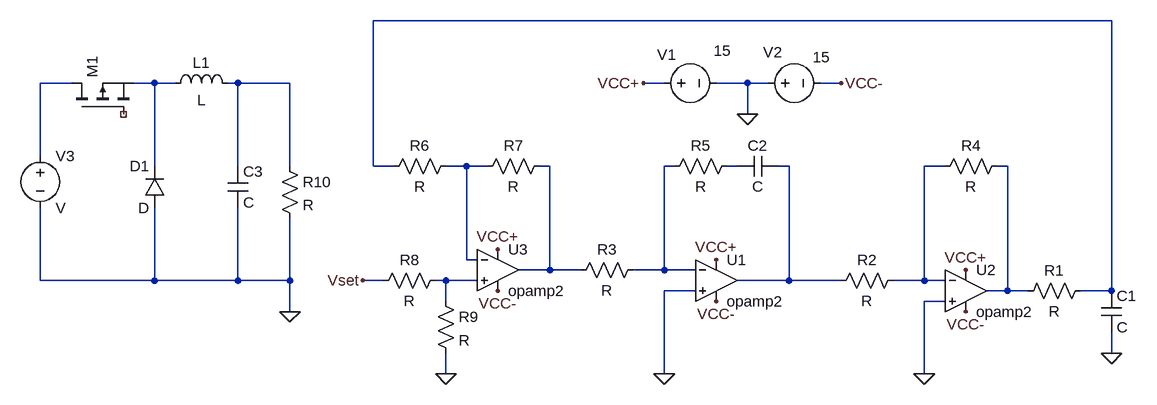
[diagram p0: schematic Pi_e_Buck_implementadando.asc]
Pi_e_Buck_implementadando.asc, the LTspice schematic file:
Version 4
SHEET 1 880 772
WIRE 768 -272 -368 -272
WIRE -832 -176 -880 -176
WIRE -704 -176 -736 -176
WIRE -672 -176 -704 -176
WIRE -576 -176 -592 -176
WIRE -496 -176 -576 -176
WIRE 80 -176 48 -176
WIRE 208 -176 160 -176
WIRE 240 -176 208 -176
WIRE 352 -176 320 -176
WIRE 208 -128 208 -176
WIRE -880 -64 -880 -176
WIRE -704 -48 -704 -176
WIRE -576 -48 -576 -176
WIRE -496 -48 -496 -176
WIRE -368 -48 -368 -272
WIRE -336 -48 -368 -48
WIRE -224 -48 -256 -48
WIRE -192 -48 -224 -48
WIRE -96 -48 -112 -48
WIRE 96 -48 80 -48
WIRE 192 -48 176 -48
WIRE 272 -48 256 -48
WIRE 512 -48 480 -48
WIRE 608 -48 592 -48
WIRE -224 96 -224 -48
WIRE -208 96 -224 96
WIRE -96 112 -96 -48
WIRE -96 112 -144 112
WIRE -48 112 -96 112
WIRE 80 112 80 -48
WIRE 80 112 32 112
WIRE 128 112 80 112
WIRE -880 128 -880 16
WIRE -704 128 -704 16
WIRE -704 128 -880 128
WIRE -576 128 -576 16
WIRE -576 128 -704 128
WIRE -496 128 -496 32
WIRE -496 128 -576 128
WIRE -352 128 -384 128
WIRE -256 128 -272 128
WIRE -208 128 -256 128
WIRE 272 128 272 -48
WIRE 272 128 192 128
WIRE 352 128 272 128
WIRE 480 128 480 -48
WIRE 480 128 432 128
WIRE 512 128 480 128
WIRE 128 144 80 144
WIRE 608 144 608 -48
WIRE 608 144 576 144
WIRE 640 144 608 144
WIRE 768 144 768 -272
WIRE 768 144 720 144
WIRE -256 160 -256 128
WIRE 512 160 480 160
WIRE -496 176 -496 128
WIRE 768 240 768 208
WIRE -256 272 -256 240
WIRE 80 272 80 144
WIRE 480 272 480 160
FLAG 768 240 0
FLAG -256 272 0
FLAG 80 272 0
FLAG 480 272 0
FLAG -384 128 Vset
FLAG -176 80 VCC+
FLAG 160 96 VCC+
FLAG 544 112 VCC+
FLAG -176 144 VCC-
FLAG 160 160 VCC-
FLAG 544 176 VCC-
FLAG 208 -128 0
FLAG 352 -176 VCC-
FLAG 48 -176 VCC+
FLAG -496 176 0
SYMBOL OpAmps\\opamp2 160 64 R0
SYMATTR InstName U1
SYMBOL OpAmps\\opamp2 544 80 R0
SYMATTR InstName U2
SYMBOL OpAmps\\opamp2 -176 48 R0
SYMATTR InstName U3
SYMBOL cap 752 144 R0
SYMATTR InstName C1
SYMBOL res 736 128 R90
WINDOW 0 0 56 VBottom 2
WINDOW 3 32 56 VTop 2
SYMATTR InstName R1
SYMBOL res 448 112 R90
WINDOW 0 0 56 VBottom 2
WINDOW 3 32 56 VTop 2
SYMATTR InstName R2
SYMBOL res 48 96 R90
WINDOW 0 0 56 VBottom 2
WINDOW 3 32 56 VTop 2
SYMATTR InstName R3
SYMBOL res 608 -64 R90
WINDOW 0 0 56 VBottom 2
WINDOW 3 32 56 VTop 2
SYMATTR InstName R4
SYMBOL res 192 -64 R90
WINDOW 0 0 56 VBottom 2
WINDOW 3 32 56 VTop 2
SYMATTR InstName R5
SYMBOL cap 256 -64 R90
WINDOW 0 0 32 VBottom 2
WINDOW 3 32 32 VTop 2
SYMATTR InstName C2
SYMBOL res -240 -64 R90
WINDOW 0 0 56 VBottom 2
WINDOW 3 32 56 VTop 2
SYMATTR InstName R6
SYMBOL res -96 -64 R90
WINDOW 0 0 56 VBottom 2
WINDOW 3 32 56 VTop 2
SYMATTR InstName R7
SYMBOL res -256 112 R90
WINDOW 0 0 56 VBottom 2
WINDOW 3 32 56 VTop 2
SYMATTR InstName R8
SYMBOL voltage 64 -176 R270
WINDOW 123 0 0 Left 0
WINDOW 39 0 0 Left 0
WINDOW 0 44 5 VRight 2
WINDOW 3 50 92 VRight 2
SYMATTR InstName V1
SYMATTR Value 15
SYMBOL voltage 224 -176 R270
WINDOW 123 0 0 Left 0
WINDOW 39 0 0 Left 0
WINDOW 0 48 8 VRight 2
WINDOW 3 40 84 VRight 2
SYMATTR InstName V2
SYMATTR Value 15
SYMBOL res -272 144 R0
SYMATTR InstName R9
SYMBOL voltage -880 -80 R0
SYMATTR InstName V3
SYMBOL ind -688 -160 R270
WINDOW 0 32 56 VTop 2
WINDOW 3 5 56 VBottom 2
SYMATTR InstName L1
SYMBOL diode -688 16 R180
WINDOW 0 24 64 Left 2
WINDOW 3 24 0 Left 2
SYMATTR InstName D1
SYMBOL res -512 -64 R0
SYMATTR InstName R10
SYMBOL cap -592 -48 R0
SYMATTR InstName C3
SYMBOL pmos -832 -128 R270
SYMATTR InstName M1
SYMATTR Value ""

The netlist it stands for:
* Pi_e_Buck_implementadando.asc
XU1 0 N007 VCC+ VCC- N009 opamp2  ; pins In+ In- V+ V- OUT
XU2 0 N010 VCC+ VCC- N011 opamp2  ; pins In+ In- V+ V- OUT
XU3 N012 N005 VCC+ VCC- N006 opamp2  ; pins In+ In- V+ V- OUT
C1 N001 0 C
R1 N001 N011 R
R2 N010 N009 R
R3 N007 N006 R
R4 N011 N010 R
R5 N008 N007 R
C2 N009 N008 C
R6 N005 N001 R
R7 N006 N005 R
R8 N012 Vset R
V1 VCC+ 0 15
V2 0 VCC- 15
R9 N012 0 R
V3 N002 0 V
L1 N003 N004 L
D1 0 N003 D
R10 N004 0 R
C3 N004 0 C
M1 N002 NC_01 N003 N003
.model D D
.lib standard.dio
.model NMOS NMOS
.model PMOS PMOS
.lib standard.mos
.backanno
.end